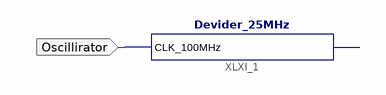
[diagram p0: schematic sheet 1]
// Xilinx ISE schematic Synch.sch (spartan6) as structural Verilog: 1 symbols, 1 ports
module Synch (
  input  Oscillirator
);

  Devider_25MHz XLXI_1 (.CLK_100MHz(Oscillirator));  // open: CLK_25MHz
endmodule
